# Altium schematic sheet 01_MCU.SchDoc
size 246 x 182 mm
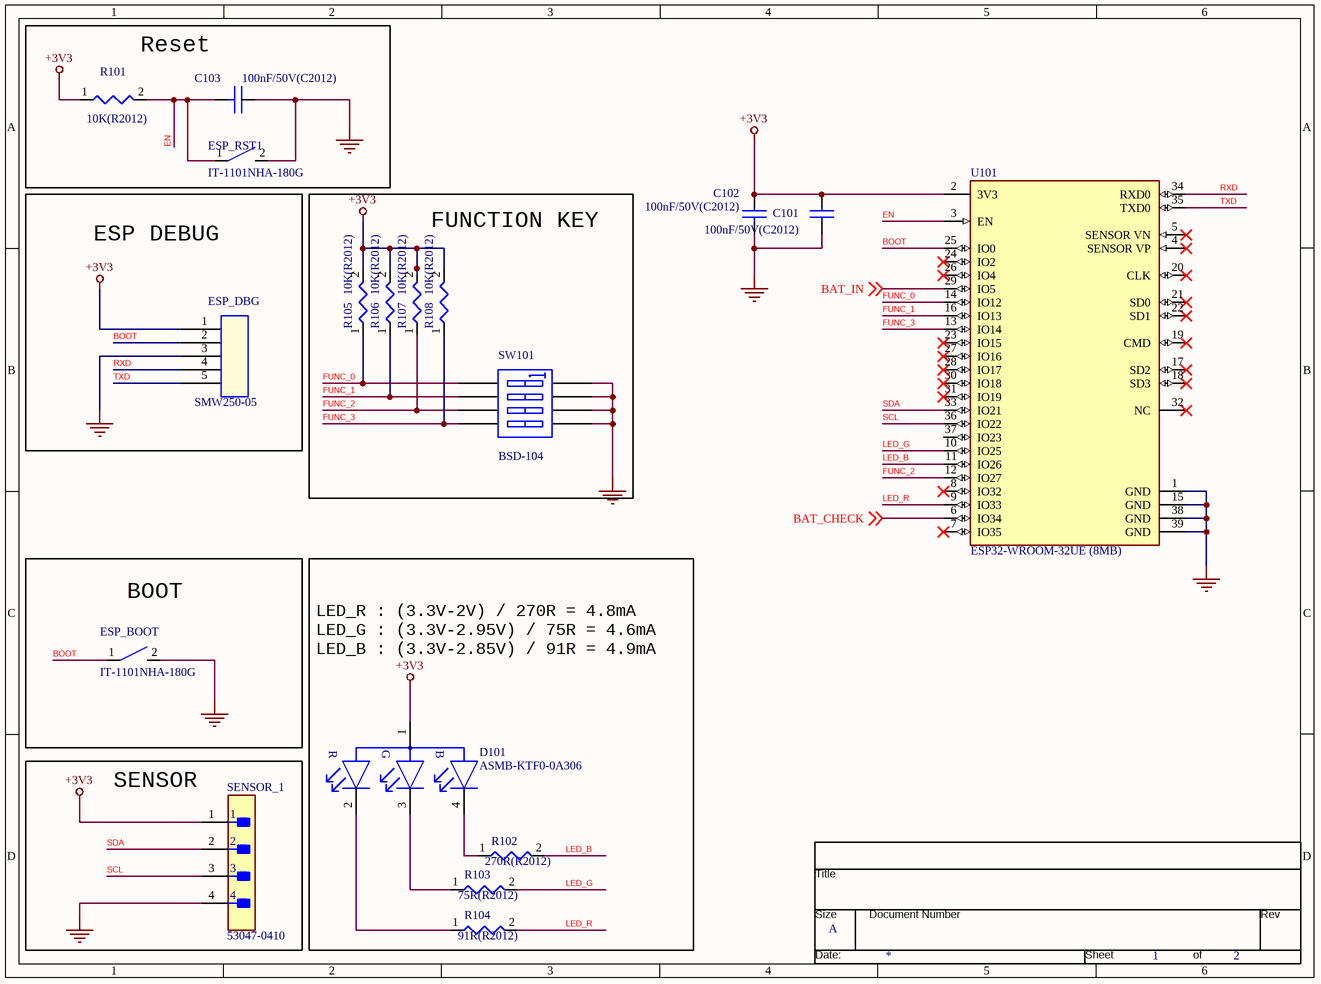
[diagram p0: 01_MCU.SchDoc]

## Parts
*  Page Count: 2  Page Number: 1  Page Size: A  (hidden comment: TitleBlock0)  (graphical)
C101  100nF/50V(C2012)  [C2012]
C102  100nF/50V(C2012)  [C2012]
C103  100nF/50V(C2012)  [C2012]
D101  ASMB-KTF0-0A306  [FP-PLCC-4-MFG]
ESP_BOOT  IT-1101NHA-180G  [SW_Tact_2p]
ESP_DBG  SMW250-05  [CON5267-05]
ESP_RST1  IT-1101NHA-180G  [SW_Tact_2p]
R101  10K(R2012)  [R2012]
R102  270R(R2012)  [R2012]
R103  75R(R2012)  [R2012]
R104  91R(R2012)  [R2012]
R105  10K(R2012)  [R2012]
R106  10K(R2012)  [R2012]
R107  10K(R2012)  [R2012]
R108  10K(R2012)  [R2012]
SENSOR_1  53047-0410  [FP-53047-0410-MFG]
SW101  BSD-104  [DIP_SW4]
U101  ESP32-WROOM-32UE (8MB)  [FP-ESP32-WROOM-32U_16MB-MFG]

## Blocks framed on the sheet
Reset: C103 ESP_RST1 R101
ESP DEBUG: ESP_DBG
FUNCTION KEY: R105-R108 SW101
BOOT: ESP_BOOT
SENSOR: SENSOR_1

## Nets
+3V3: C101.1 C102.1 D101.1(A) ESP_DBG.1 R101.1 R105.2 R106.2 R107.2 R108.2 SENSOR_1.1 U101.2(3V3)
GND: C101.2 C102.2 C103.1 ESP_BOOT.2 ESP_DBG.3 ESP_RST1.2 SENSOR_1.4 SW101.5(B4) SW101.6(B3) SW101.7(B2) SW101.8(B1) U101.1(GND) U101.15(GND) U101.38(GND) U101.39(GND)
BAT_CHECK: U101.6(IO34) ; off-sheet BAT_CHECK
BAT_IN: U101.29(IO5) ; off-sheet BAT_IN
BOOT: ESP_BOOT.1 ESP_DBG.2 U101.25(IO0)
EN: C103.2 ESP_RST1.1 R101.2 U101.3(EN)
FUNC_0: R105.1 SW101.1(A1) U101.14(IO12)
FUNC_1: R106.1 SW101.2(A2) U101.16(IO13)
FUNC_2: R107.1 SW101.3(A3) U101.12(IO27)
FUNC_3: R108.1 SW101.4(A4) U101.13(IO14)
LED_B: R102.2 U101.11(IO26)
LED_G: R103.2 U101.10(IO25)
LED_R: R104.2 U101.9(IO33)
RXD: ESP_DBG.4 U101.34(RXD0)
SCL: SENSOR_1.3 U101.36(IO22)
SDA: SENSOR_1.2 U101.33(IO21)
TXD: ESP_DBG.5 U101.35(TXD0)
NetD101_2: D101.2(Red_C) R104.1
NetD101_3: D101.3(Green_C) R103.1
NetD101_4: D101.4(Blue_C) R102.1

Not connected (* = marked no-connect by the designer): U101 4(SENSOR_VP)* 5(SENSOR_VN)* 7(IO35)* 8(IO32)* 17(SD2)* 18(SD3)* 19(CMD)* 20(CLK)* 21(SD0)* 22(SD1)* 23(IO15)* 24(IO2)* 26(IO4)* 27(IO16)* 28(IO17)* 30(IO18)* 31(IO19)* 32(NC)* 37(IO23)

## Notes on the sheet
- LED_R : (3.3V-2V) / 270R = 4.8mA
  LED_G : (3.3V-2.95V) / 75R = 4.6mA
  LED_B : (3.3V-2.85V) / 91R = 4.9mA
- (in symbol CMP-18399-000003-1) R; G; B
- (in symbol TitleBlock0) Title; Size; Document Number; Rev; Date:; Sheet; of

## Library data of the parts
C101 C102 = CAP NP_0: PCB Footprint: C2012
C103 = C_0: PCB Footprint: C2012
D101 = CMP-18399-000003-1: LED RGB 4PLCC SMD; Manufacturer: Broadcom; Peak Emmision Wavelength: 467/518/628nm; Luminous Intensity: 215/1100/490mcd; Power Dissipation: 66/66/48mW; Led Orientation: Top View; Colour: Blue, Green, Red; Wavelength: 471/524/620nm; Forward Current: 10/15/15mA; Reverse Voltage: 4V; Viewing Angle: 110°; Forward Voltage: 2.85/2.95/2V; Max Junction Temp: +100°C; Digikey Description: LED RGB 4PLCC SMD; ComponentLink2URL: https://docs.broadcom.com/docs/ASMB-KTF0-0A306-DS100; ComponentLink2Description: Datasheet; Manufacturer Part Number: ASMB-KTF0-0A306; Temperature Range Low: -40°C; Device Class L2: LEDs; RoHS: TRUE; Octopart: https://octopart.com/asmb-ktf0-0a306-broadcom-87157377; Package: PLCC-4; Mouser Description: LED Multi-Color Chip Red/Green/Blue 620nm/524nm/471nm 20mA 4-Pin PLCC T/R; Category: Diode; Lead Free: Yes; Height: 2.1mm; Temperature: -40°C to +85°C; Device Class L1: Optoelectronics; Automotive: No; Temperature Range High: +85°C; Device Class L3: unset
ESP_BOOT ESP_RST1 = SWITCH: PCB Footprint: IT-1101NHA-180G
ESP_DBG = CON5: PCB Footprint: SMW250-05
R101-R108 = R_3: PCB Footprint: R2012
SENSOR_1 = CMP-04776-000321-1: CONN HEADER VERT 4POS 1.25MM; Plating: Tin; Number of Positions: 4; Voltage Rating (AC): 125V; Insulation Resistance: 100MR; Current Rating: 1A; Glow Wire Compliant: Non-compliant; Contact Resistance: 20mR; Gender: Male; Series: PicoBlade; Contact Material: Bronze; Number of Circuits: 4; Voltage Rating (DC): 125V; Working Voltage: 125V; Termination: Solder; Pitch: 1.25mm; Housing Material: Polyamide; Orientation: Vertical; Current: 1A; Flammability Rating: UL94 V-0; Max Voltage Rating (AC): 125V; Housing Color: Natural; Package Quantity: 5000; Mount: Through Hole; Case/Package: 0410; Max Operating Temperature: 85°C; RoHS Compliant: Yes; Voltage Rating: 125V; Lead Free: Lead Free; Packaging: Tray; Color: Natural; Contact Plating: Tin; Number of Rows: 1; Radiation Hardening: No; Min Operating Temperature: -40°C; Voltage: 125V; Number of Contacts: 4
SW101 = SW DIP-4
U101 = CMP-194065-000029-1: RX TXRX MODULE WIFI U.FL SMD; Sensitivity: -98dBm; Frequency: 2.5GHz; Memory Size: 536KB; Data Rate: 150Mbps; Interface: I2C; Packaging: Tape and Reel; Case/Package: SMD/SMT; Max Operating Temperature: 85°C; Mount: Surface Mount; Min Operating Temperature: -40°C
* = TitleBlock0: Page Create Date: March  8, 1995; Page Modify Date: *